# EasyEDA Pro project pcb.epro

# Schematic Schematic1
Board Name: Board1; Create Date: 2025-01-27; Page Name: P1; Project Name: pcb; Schematic Name: Schematic1; Update Date: 2025-01-28; Company: EasyEDA.com; Page Size: A4; Version: V1.0
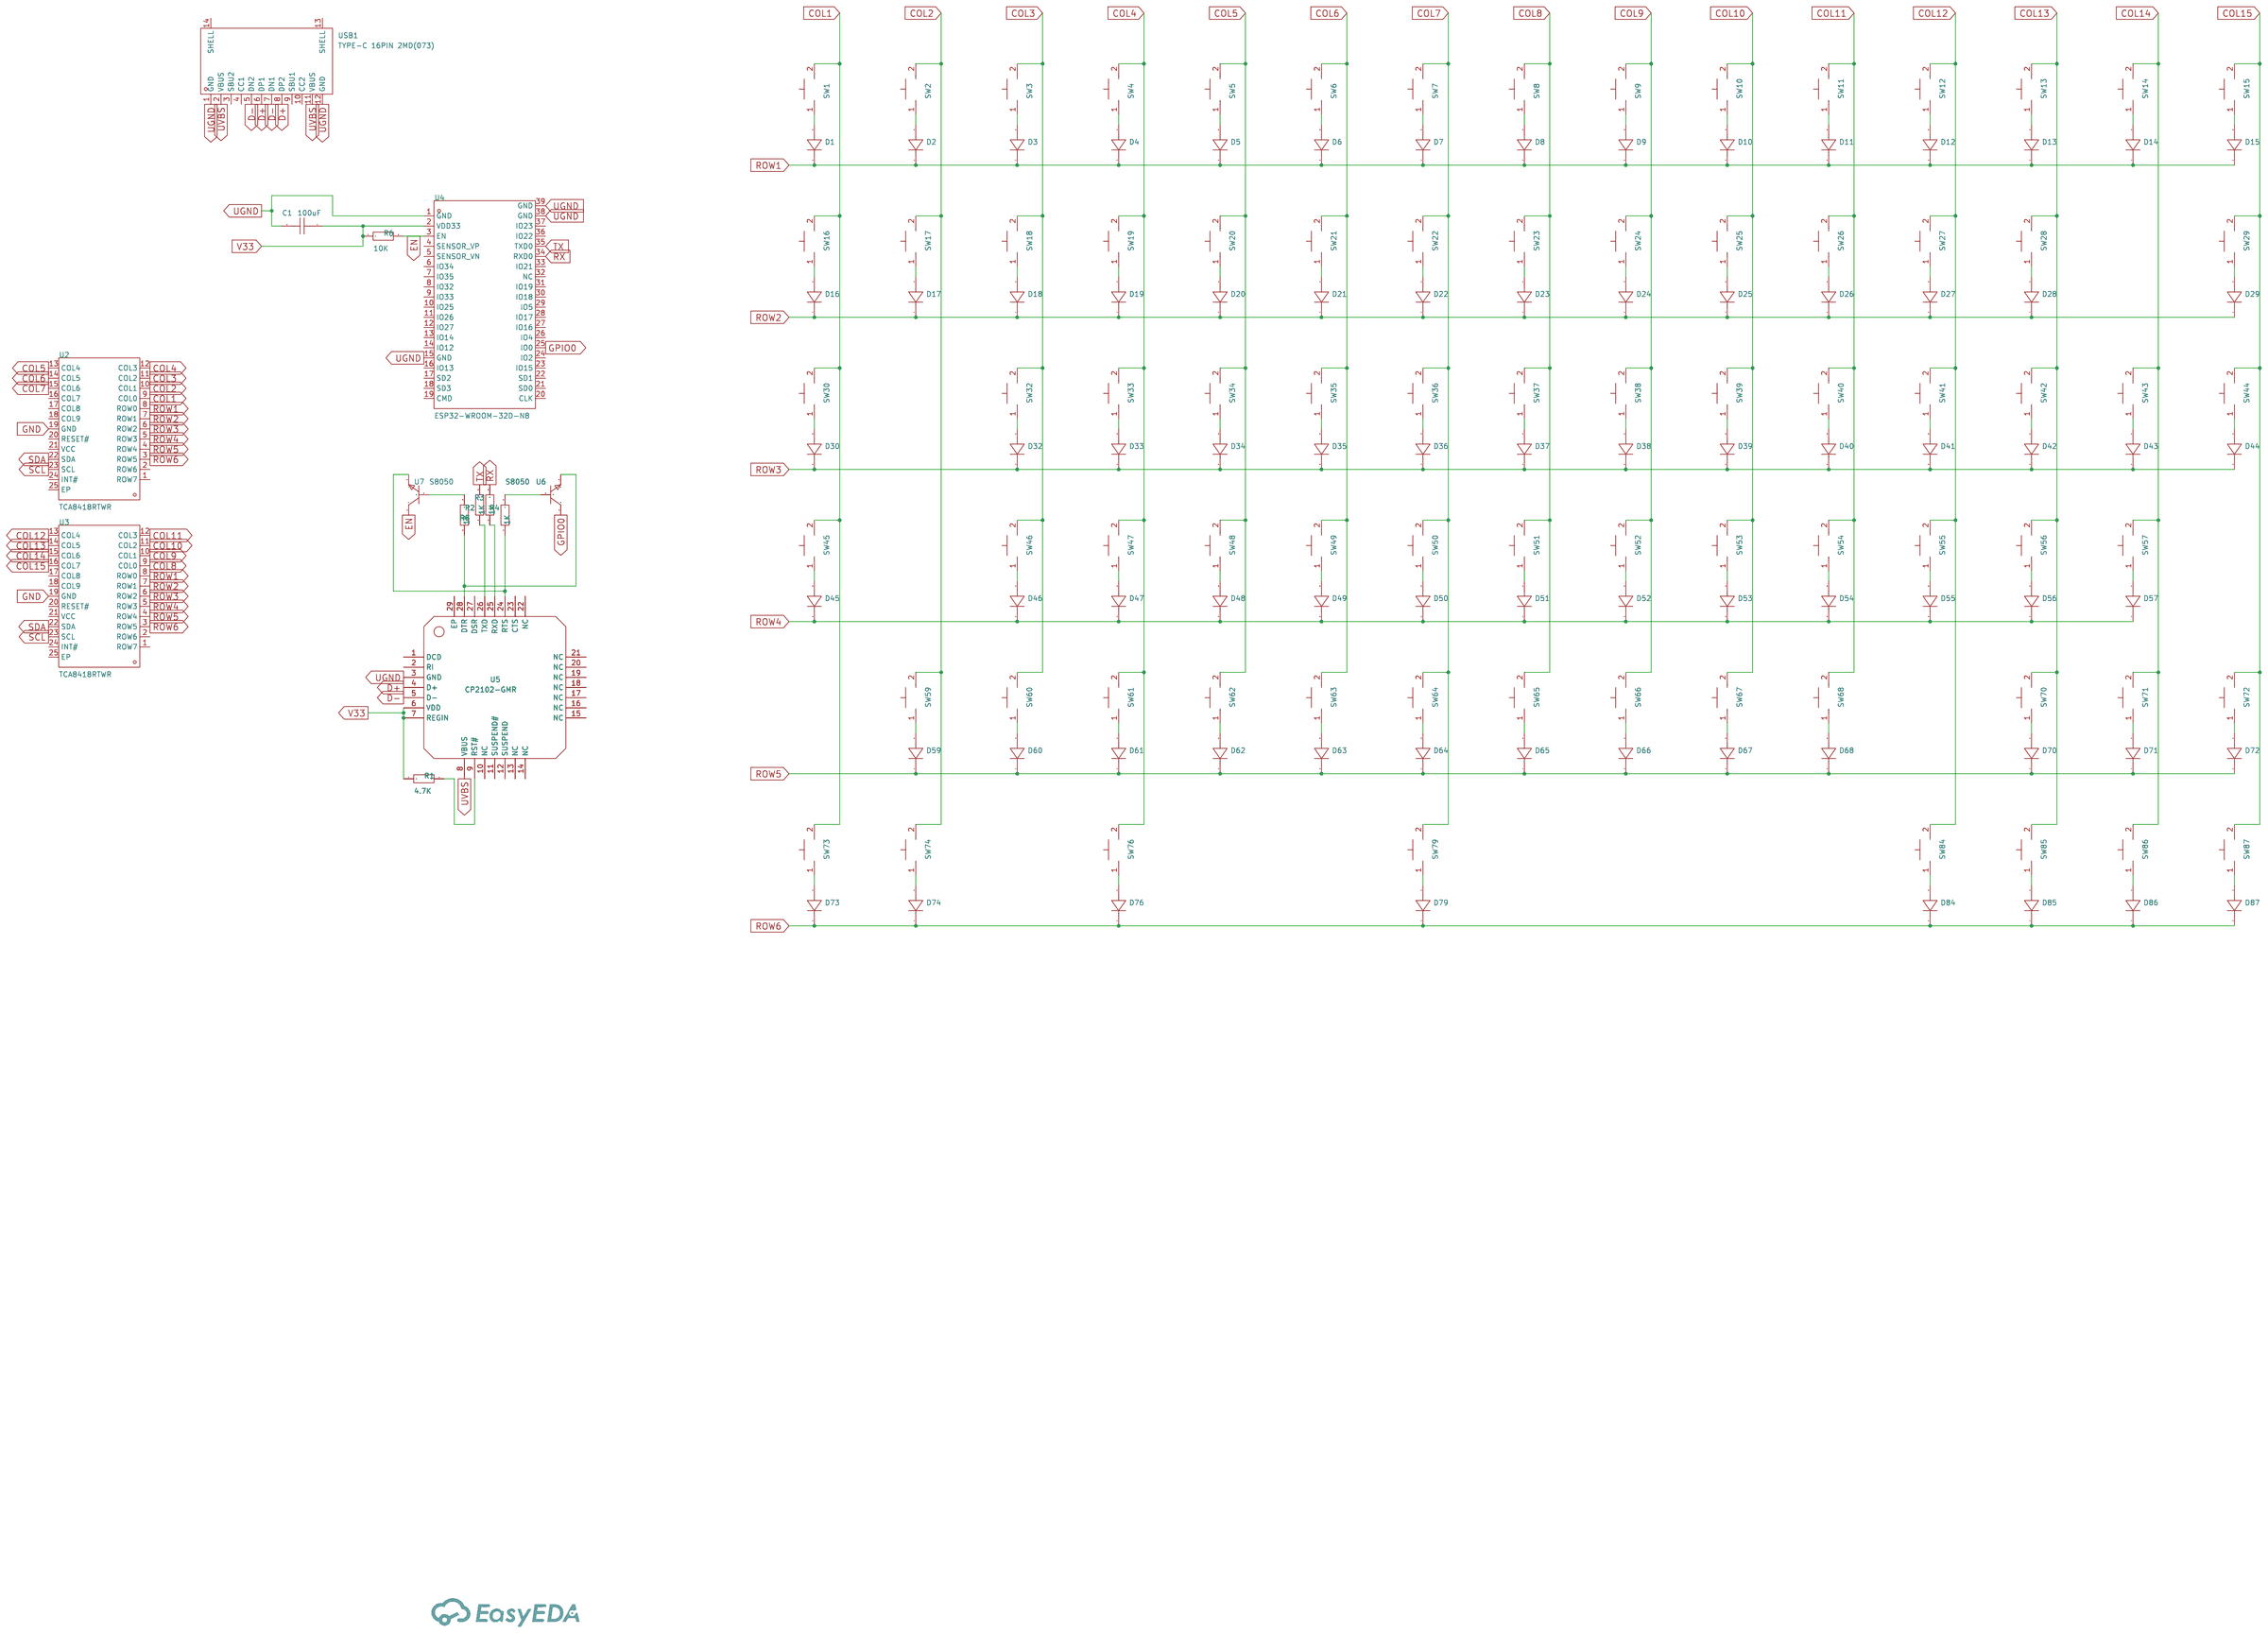
[diagram p0: schematic sheet]

## Parts
C1  100uF  [C0603]
D1  -  [DO-41_BD2.4-L4.7-P8.70-D0.9-RD]
D2  -  [DO-41_BD2.4-L4.7-P8.70-D0.9-RD]
D3  -  [DO-41_BD2.4-L4.7-P8.70-D0.9-RD]
D4  -  [DO-41_BD2.4-L4.7-P8.70-D0.9-RD]
D5  -  [DO-41_BD2.4-L4.7-P8.70-D0.9-RD]
D6  -  [DO-41_BD2.4-L4.7-P8.70-D0.9-RD]
D7  -  [DO-41_BD2.4-L4.7-P8.70-D0.9-RD]
D8  -  [DO-41_BD2.4-L4.7-P8.70-D0.9-RD]
D9  -  [DO-41_BD2.4-L4.7-P8.70-D0.9-RD]
D10  -  [DO-41_BD2.4-L4.7-P8.70-D0.9-RD]
D11  -  [DO-41_BD2.4-L4.7-P8.70-D0.9-RD]
D12  -  [DO-41_BD2.4-L4.7-P8.70-D0.9-RD]
D13  -  [DO-41_BD2.4-L4.7-P8.70-D0.9-RD]
D14  -  [DO-41_BD2.4-L4.7-P8.70-D0.9-RD]
D15  -  [DO-41_BD2.4-L4.7-P8.70-D0.9-RD]
D16  -  [DO-41_BD2.4-L4.7-P8.70-D0.9-RD]
D17  -  [DO-41_BD2.4-L4.7-P8.70-D0.9-RD]
D18  -  [DO-41_BD2.4-L4.7-P8.70-D0.9-RD]
D19  -  [DO-41_BD2.4-L4.7-P8.70-D0.9-RD]
D20  -  [DO-41_BD2.4-L4.7-P8.70-D0.9-RD]
D21  -  [DO-41_BD2.4-L4.7-P8.70-D0.9-RD]
D22  -  [DO-41_BD2.4-L4.7-P8.70-D0.9-RD]
D23  -  [DO-41_BD2.4-L4.7-P8.70-D0.9-RD]
D24  -  [DO-41_BD2.4-L4.7-P8.70-D0.9-RD]
D25  -  [DO-41_BD2.4-L4.7-P8.70-D0.9-RD]
D26  -  [DO-41_BD2.4-L4.7-P8.70-D0.9-RD]
D27  -  [DO-41_BD2.4-L4.7-P8.70-D0.9-RD]
D28  -  [DO-41_BD2.4-L4.7-P8.70-D0.9-RD]
D29  -  [DO-41_BD2.4-L4.7-P8.70-D0.9-RD]
D30  -  [DO-41_BD2.4-L4.7-P8.70-D0.9-RD]
D32  -  [DO-41_BD2.4-L4.7-P8.70-D0.9-RD]
D33  -  [DO-41_BD2.4-L4.7-P8.70-D0.9-RD]
D34  -  [DO-41_BD2.4-L4.7-P8.70-D0.9-RD]
D35  -  [DO-41_BD2.4-L4.7-P8.70-D0.9-RD]
D36  -  [DO-41_BD2.4-L4.7-P8.70-D0.9-RD]
D37  -  [DO-41_BD2.4-L4.7-P8.70-D0.9-RD]
D38  -  [DO-41_BD2.4-L4.7-P8.70-D0.9-RD]
D39  -  [DO-41_BD2.4-L4.7-P8.70-D0.9-RD]
D40  -  [DO-41_BD2.4-L4.7-P8.70-D0.9-RD]
D41  -  [DO-41_BD2.4-L4.7-P8.70-D0.9-RD]
D42  -  [DO-41_BD2.4-L4.7-P8.70-D0.9-RD]
D43  -  [DO-41_BD2.4-L4.7-P8.70-D0.9-RD]
D44  -  [DO-41_BD2.4-L4.7-P8.70-D0.9-RD]
D45  -  [DO-41_BD2.4-L4.7-P8.70-D0.9-RD]
D46  -  [DO-41_BD2.4-L4.7-P8.70-D0.9-RD]
D47  -  [DO-41_BD2.4-L4.7-P8.70-D0.9-RD]
D48  -  [DO-41_BD2.4-L4.7-P8.70-D0.9-RD]
D49  -  [DO-41_BD2.4-L4.7-P8.70-D0.9-RD]
D50  -  [DO-41_BD2.4-L4.7-P8.70-D0.9-RD]
D51  -  [DO-41_BD2.4-L4.7-P8.70-D0.9-RD]
D52  -  [DO-41_BD2.4-L4.7-P8.70-D0.9-RD]
D53  -  [DO-41_BD2.4-L4.7-P8.70-D0.9-RD]
D54  -  [DO-41_BD2.4-L4.7-P8.70-D0.9-RD]
D55  -  [DO-41_BD2.4-L4.7-P8.70-D0.9-RD]
D56  -  [DO-41_BD2.4-L4.7-P8.70-D0.9-RD]
D57  -  [DO-41_BD2.4-L4.7-P8.70-D0.9-RD]
D59  -  [DO-41_BD2.4-L4.7-P8.70-D0.9-RD]
D60  -  [DO-41_BD2.4-L4.7-P8.70-D0.9-RD]
D61  -  [DO-41_BD2.4-L4.7-P8.70-D0.9-RD]
D62  -  [DO-41_BD2.4-L4.7-P8.70-D0.9-RD]
D63  -  [DO-41_BD2.4-L4.7-P8.70-D0.9-RD]
D64  -  [DO-41_BD2.4-L4.7-P8.70-D0.9-RD]
D65  -  [DO-41_BD2.4-L4.7-P8.70-D0.9-RD]
D66  -  [DO-41_BD2.4-L4.7-P8.70-D0.9-RD]
D67  -  [DO-41_BD2.4-L4.7-P8.70-D0.9-RD]
D68  -  [DO-41_BD2.4-L4.7-P8.70-D0.9-RD]
D70  -  [DO-41_BD2.4-L4.7-P8.70-D0.9-RD]
D71  -  [DO-41_BD2.4-L4.7-P8.70-D0.9-RD]
D72  -  [DO-41_BD2.4-L4.7-P8.70-D0.9-RD]
D73  -  [DO-41_BD2.4-L4.7-P8.70-D0.9-RD]
D74  -  [DO-41_BD2.4-L4.7-P8.70-D0.9-RD]
D76  -  [DO-41_BD2.4-L4.7-P8.70-D0.9-RD]
D79  -  [DO-41_BD2.4-L4.7-P8.70-D0.9-RD]
D84  -  [DO-41_BD2.4-L4.7-P8.70-D0.9-RD]
D85  -  [DO-41_BD2.4-L4.7-P8.70-D0.9-RD]
D86  -  [DO-41_BD2.4-L4.7-P8.70-D0.9-RD]
D87  -  [DO-41_BD2.4-L4.7-P8.70-D0.9-RD]
R1  4.7K  [R0603]
R2  1K  [R0603]
R3  1K  [R0603]
R4  1K  [R0603]
R5  1K  [R0603]
R6  10K  [R0603]
SW1  CPG151101S11-16  [SMD_KEYBOARD-SW]
SW2  CPG151101S11-16  [SMD_KEYBOARD-SW]
SW3  CPG151101S11-16  [SMD_KEYBOARD-SW]
SW4  CPG151101S11-16  [SMD_KEYBOARD-SW]
SW5  CPG151101S11-16  [SMD_KEYBOARD-SW]
SW6  CPG151101S11-16  [SMD_KEYBOARD-SW]
SW7  CPG151101S11-16  [SMD_KEYBOARD-SW]
SW8  CPG151101S11-16  [SMD_KEYBOARD-SW]
SW9  CPG151101S11-16  [SMD_KEYBOARD-SW]
SW10  CPG151101S11-16  [SMD_KEYBOARD-SW]
SW11  CPG151101S11-16  [SMD_KEYBOARD-SW]
SW12  CPG151101S11-16  [SMD_KEYBOARD-SW]
SW13  CPG151101S11-16  [SMD_KEYBOARD-SW]
SW14  CPG151101S11-16  [SMD_KEYBOARD-SW]
SW15  CPG151101S11-16  [SMD_KEYBOARD-SW]
SW16  CPG151101S11-16  [SMD_KEYBOARD-SW]
SW17  CPG151101S11-16  [SMD_KEYBOARD-SW]
SW18  CPG151101S11-16  [SMD_KEYBOARD-SW]
SW19  CPG151101S11-16  [SMD_KEYBOARD-SW]
SW20  CPG151101S11-16  [SMD_KEYBOARD-SW]
SW21  CPG151101S11-16  [SMD_KEYBOARD-SW]
SW22  CPG151101S11-16  [SMD_KEYBOARD-SW]
SW23  CPG151101S11-16  [SMD_KEYBOARD-SW]
SW24  CPG151101S11-16  [SMD_KEYBOARD-SW]
SW25  CPG151101S11-16  [SMD_KEYBOARD-SW]
SW26  CPG151101S11-16  [SMD_KEYBOARD-SW]
SW27  CPG151101S11-16  [SMD_KEYBOARD-SW]
SW28  CPG151101S11-16  [SMD_KEYBOARD-SW]
SW29  CPG151101S11-16  [SMD_KEYBOARD-SW]
SW30  CPG151101S11-16  [SMD_KEYBOARD-SW]
SW32  CPG151101S11-16  [SMD_KEYBOARD-SW]
SW33  CPG151101S11-16  [SMD_KEYBOARD-SW]
SW34  CPG151101S11-16  [SMD_KEYBOARD-SW]
SW35  CPG151101S11-16  [SMD_KEYBOARD-SW]
SW36  CPG151101S11-16  [SMD_KEYBOARD-SW]
SW37  CPG151101S11-16  [SMD_KEYBOARD-SW]
SW38  CPG151101S11-16  [SMD_KEYBOARD-SW]
SW39  CPG151101S11-16  [SMD_KEYBOARD-SW]
SW40  CPG151101S11-16  [SMD_KEYBOARD-SW]
SW41  CPG151101S11-16  [SMD_KEYBOARD-SW]
SW42  CPG151101S11-16  [SMD_KEYBOARD-SW]
SW43  CPG151101S11-16  [SMD_KEYBOARD-SW]
SW44  CPG151101S11-16  [SMD_KEYBOARD-SW]
SW45  CPG151101S11-16  [SMD_KEYBOARD-SW]
SW46  CPG151101S11-16  [SMD_KEYBOARD-SW]
SW47  CPG151101S11-16  [SMD_KEYBOARD-SW]
SW48  CPG151101S11-16  [SMD_KEYBOARD-SW]
SW49  CPG151101S11-16  [SMD_KEYBOARD-SW]
SW50  CPG151101S11-16  [SMD_KEYBOARD-SW]
SW51  CPG151101S11-16  [SMD_KEYBOARD-SW]
SW52  CPG151101S11-16  [SMD_KEYBOARD-SW]
SW53  CPG151101S11-16  [SMD_KEYBOARD-SW]
SW54  CPG151101S11-16  [SMD_KEYBOARD-SW]
SW55  CPG151101S11-16  [SMD_KEYBOARD-SW]
SW56  CPG151101S11-16  [SMD_KEYBOARD-SW]
SW57  CPG151101S11-16  [SMD_KEYBOARD-SW]
SW59  CPG151101S11-16  [SMD_KEYBOARD-SW]
SW60  CPG151101S11-16  [SMD_KEYBOARD-SW]
SW61  CPG151101S11-16  [SMD_KEYBOARD-SW]
SW62  CPG151101S11-16  [SMD_KEYBOARD-SW]
SW63  CPG151101S11-16  [SMD_KEYBOARD-SW]
SW64  CPG151101S11-16  [SMD_KEYBOARD-SW]
SW65  CPG151101S11-16  [SMD_KEYBOARD-SW]
SW66  CPG151101S11-16  [SMD_KEYBOARD-SW]
SW67  CPG151101S11-16  [SMD_KEYBOARD-SW]
SW68  CPG151101S11-16  [SMD_KEYBOARD-SW]
SW70  CPG151101S11-16  [SMD_KEYBOARD-SW]
SW71  CPG151101S11-16  [SMD_KEYBOARD-SW]
SW72  CPG151101S11-16  [SMD_KEYBOARD-SW]
SW73  CPG151101S11-16  [SMD_KEYBOARD-SW]
SW74  CPG151101S11-16  [SMD_KEYBOARD-SW]
SW76  CPG151101S11-16  [SMD_KEYBOARD-SW]
SW79  CPG151101S11-16  [SMD_KEYBOARD-SW]
SW84  CPG151101S11-16  [SMD_KEYBOARD-SW]
SW85  CPG151101S11-16  [SMD_KEYBOARD-SW]
SW86  CPG151101S11-16  [SMD_KEYBOARD-SW]
SW87  CPG151101S11-16  [SMD_KEYBOARD-SW]
U2  TCA8418RTWR  [WQFN-24_L4.0-W4.0-P0.50-TL-EP2.5]
U3  TCA8418RTWR  [WQFN-24_L4.0-W4.0-P0.50-TL-EP2.5]
U4  ESP32-WROOM-32D-N8  [WIFIM-SMD_39P-L25.5-W18.0-P1.27]
U5  CP2102-GMR  [WQFN-28_L5.0-W5.0-P0.50-BL-EP3.2]
U6  S8050  [SOT-23-3_L2.9-W1.3-P0.95-LS2.4-BR]
U7  S8050  [SOT-23-3_L2.9-W1.3-P0.95-LS2.4-BR]
USB1  TYPE-C 16PIN 2MD(073)  [USB-C-SMD_TYPE-C-6PIN-2MD-073]

## Library data of the parts
C1 = CAP_0603: Supplier Footprint: 0603
D1-D30 D32-D57 D59-D68 D70-D74 D76 D79 D84-D87 = 1N4007: Supplier Footprint: DO-41
R1-R6 = Res_0603: Supplier Footprint: 0603
SW1-SW30 SW32-SW57 SW59-SW68 SW70-SW74 SW76 SW79 SW84-SW87 = CPG151101S11-16_C41430893: LCSC Part Name: 热插拔底座连接器 键盘配件; Supplier Part: C41430893; Manufacturer: HanElectricity(瀚源); Supplier Footprint: SMD,14.5x5.9mm; JLCPCB Part Class: Extended Part; Datasheet: https://atta.szlcsc.com/upload/public/pdf/source/20241016/CAB9C3DABBAD4306660C041376EEF732.pdf; Supplier: LCSC
U2 U3 = TCA8418RTWR: Interface:I2C Number of I/O:18 Interrupt Output:With Interrupt Output Output Type:Leakage Supply Voltage:1.65V~3.6V Supply Voltage:1.65V~3.6V Output Source current:- Output Sink Current:- Clock Frequency:1MHz Operating Temperature:-40℃~+85℃ Operating Temp; LCSC Part Name: TCA8418集成ESD保护的I²C控制键盘扫描IC; Supplier Part: C138713; Manufacturer: TI(德州仪器); Supplier Footprint: WQFN-24-EP(4x4); JLCPCB Part Class: Extended Part; Datasheet: https://www.ti.com/cn/lit/gpn/tca8418; Supplier: LCSC; Interface: I2C; Number of I/O: 18; Interrupt Output: With Interrupt Output; Output Type: Leakage; Supply Voltage: 1.65V~3.6V; Clock Frequency: 1MHz; Operating Temperature: -40℃~+85℃
U4 = ESP32-WROOM-32D-N8: LCSC Part Name: 通用型Wi-Fi+BT+BLE MCU模组; Supplier Part: C529577; Manufacturer: ESPRESSIF(乐鑫); Supplier Footprint: SMD,18x25.5mm; JLCPCB Part Class: Extended Part; Datasheet: https://atta.szlcsc.com/upload/public/pdf/source/20241030/FABBD8327B67EE0A7C31EF04AF2F47D2.pdf; Supplier: LCSC
U5 = CP2102-GMR: Applications Function:Transceiver Protocol: Number of Channels:- Supply Voltage:3V~3.6V Supply Voltage:3V~3.6V Data Rate:12Mbps Operating Temperature:- Operating Temperature:-; LCSC Part Name: 单芯片USB转UART桥接器; Supplier Part: C6568; Manufacturer: SKYWORKS/SILICON LABS(芯科); Supplier Footprint: WQFN-28-EP(5x5); JLCPCB Part Class: Extended Part; Datasheet: https://atta.szlcsc.com/upload/public/pdf/source/20170103/1483439882795.pdf; Supplier: LCSC; Applications Function: Transceiver; Supply Voltage: 3V~3.6V; Data Rate: 12Mbps
U6 U7 = S8050_C18195380: Supplier Part: C18195380; Manufacturer: LJ(朗捷）; Supplier Footprint: SOT-23; JLCPCB Part Class: Extended Part; Datasheet: https://atta.szlcsc.com/upload/public/pdf/source/20230921/A588E058E59BF9C5C88E8D353EF40AF6.pdf; Supplier: LCSC
USB1 = TYPE-C 16PIN 2MD(073): Connector Type:Type-C Standard:USB 3.1 Gender:Female Mounting Style:Horizontal attachment Number of Contacts:16P Number of Ports:1 Current Rating - Power (Max):5A Operating Temperature Range:-25℃~+85℃ Operating Temperature Range:-25℃~+85℃ Rated Voltage (M; LCSC Part Name: Type-C 母 卧贴; Supplier Part: C2765186; Manufacturer: SHOU HAN(首韩); Supplier Footprint: SMD; JLCPCB Part Class: Extended Part; Datasheet: https://atta.szlcsc.com/upload/public/pdf/source/20211123/39B17C16241EAC15C5E277BDA434118E.pdf; Supplier: LCSC; Connector Type: Type-C; Standard: USB 3.1; Gender: Female; Mounting Style: Horizontal attachment; Number of Contacts: 16P; Number of Ports: 1; Current Rating - Power (Max): 5A; Operating Temperature Range: -25℃~+85℃; Rated Voltage (Max): 5V; Connect-Disconnect Life: 5000 Cuts; Core Colour: Black

## Nets
GND: U2.19(GND) U3.19(GND)
V33: C1.1 R1.1 R6.1 U4.2(VDD33) U5.6(VDD) U5.7(REGIN)
COL1: SW1.2 SW16.2 SW30.2 SW45.2 SW73.2 U2.9(COL0)
COL2: SW2.2 SW17.2 SW59.2 SW74.2 U2.10(COL1)
COL3: SW3.2 SW18.2 SW32.2 SW46.2 SW60.2 U2.11(COL2)
COL4: SW4.2 SW19.2 SW33.2 SW47.2 SW61.2 SW76.2 U2.12(COL3)
COL5: SW5.2 SW20.2 SW34.2 SW48.2 SW62.2 U2.13(COL4)
COL6: SW6.2 SW21.2 SW35.2 SW49.2 SW63.2 U2.14(COL5)
COL7: SW7.2 SW22.2 SW36.2 SW50.2 SW64.2 SW79.2 U2.15(COL6)
COL8: SW8.2 SW23.2 SW37.2 SW51.2 SW65.2 U3.9(COL0)
COL9: SW9.2 SW24.2 SW38.2 SW52.2 SW66.2 U3.10(COL1)
COL10: SW10.2 SW25.2 SW39.2 SW53.2 SW67.2 U3.11(COL2)
COL11: SW11.2 SW26.2 SW40.2 SW54.2 SW68.2 U3.12(COL3)
COL12: SW12.2 SW27.2 SW41.2 SW55.2 SW84.2 U3.13(COL4)
COL13: SW13.2 SW28.2 SW42.2 SW56.2 SW70.2 SW85.2 U3.14(COL5)
COL14: SW14.2 SW43.2 SW57.2 SW71.2 SW86.2 U3.15(COL6)
COL15: SW15.2 SW29.2 SW44.2 SW72.2 SW87.2 U3.16(COL7)
D+: U5.4(D+) USB1.6(DP1) USB1.8(DP2)
D-: U5.5(D-) USB1.5(DN2) USB1.7(DN1)
EN: R6.2 U4.3(EN) U7.3(C)
GPIO0: U4.25(IO0) U6.3(C)
ROW1: D1.1(K) D2.1(K) D3.1(K) D4.1(K) D5.1(K) D6.1(K) D7.1(K) D8.1(K) D9.1(K) D10.1(K) D11.1(K) D12.1(K) D13.1(K) D14.1(K) D15.1(K) U2.8(ROW0) U3.8(ROW0)
ROW2: D16.1(K) D17.1(K) D18.1(K) D19.1(K) D20.1(K) D21.1(K) D22.1(K) D23.1(K) D24.1(K) D25.1(K) D26.1(K) D27.1(K) D28.1(K) D29.1(K) U2.7(ROW1) U3.7(ROW1)
ROW3: D30.1(K) D32.1(K) D33.1(K) D34.1(K) D35.1(K) D36.1(K) D37.1(K) D38.1(K) D39.1(K) D40.1(K) D41.1(K) D42.1(K) D43.1(K) D44.1(K) U2.6(ROW2) U3.6(ROW2)
ROW4: D45.1(K) D46.1(K) D47.1(K) D48.1(K) D49.1(K) D50.1(K) D51.1(K) D52.1(K) D53.1(K) D54.1(K) D55.1(K) D56.1(K) D57.1(K) U2.5(ROW3) U3.5(ROW3)
ROW5: D59.1(K) D60.1(K) D61.1(K) D62.1(K) D63.1(K) D64.1(K) D65.1(K) D66.1(K) D67.1(K) D68.1(K) D70.1(K) D71.1(K) D72.1(K) U2.4(ROW4) U3.4(ROW4)
ROW6: D73.1(K) D74.1(K) D76.1(K) D79.1(K) D84.1(K) D85.1(K) D86.1(K) D87.1(K) U2.3(ROW5) U3.3(ROW5)
RX: R3.2 U4.34(RXD0)
SCL: U2.23(SCL) U3.23(SCL)
SDA: U2.22(SDA) U3.22(SDA)
TX: R2.2 U4.35(TXD0)
UGND: C1.2 U4.1(GND) U4.15(GND) U4.38(GND) U4.39(GND) U5.3(GND) USB1.1(GND) USB1.12(GND)
UVBS: U5.8(VBUS) USB1.2(VBUS) USB1.11(VBUS)
Net-(D1-2): D1.2(A) SW1.1
Net-(D2-2): D2.2(A) SW2.1
Net-(D3-2): D3.2(A) SW3.1
Net-(D4-2): D4.2(A) SW4.1
Net-(D5-2): D5.2(A) SW5.1
Net-(D6-2): D6.2(A) SW6.1
Net-(D7-2): D7.2(A) SW7.1
Net-(D8-2): D8.2(A) SW8.1
Net-(D9-2): D9.2(A) SW9.1
Net-(D10-2): D10.2(A) SW10.1
Net-(D11-2): D11.2(A) SW11.1
Net-(D12-2): D12.2(A) SW12.1
Net-(D13-2): D13.2(A) SW13.1
Net-(D14-2): D14.2(A) SW14.1
Net-(D15-2): D15.2(A) SW15.1
Net-(D16-2): D16.2(A) SW16.1
Net-(D17-2): D17.2(A) SW17.1
Net-(D18-2): D18.2(A) SW18.1
Net-(D19-2): D19.2(A) SW19.1
Net-(D20-2): D20.2(A) SW20.1
Net-(D21-2): D21.2(A) SW21.1
Net-(D22-2): D22.2(A) SW22.1
Net-(D23-2): D23.2(A) SW23.1
Net-(D24-2): D24.2(A) SW24.1
Net-(D25-2): D25.2(A) SW25.1
Net-(D26-2): D26.2(A) SW26.1
Net-(D27-2): D27.2(A) SW27.1
Net-(D28-2): D28.2(A) SW28.1
Net-(D29-2): D29.2(A) SW29.1
Net-(D30-2): D30.2(A) SW30.1
Net-(D32-2): D32.2(A) SW32.1
Net-(D33-2): D33.2(A) SW33.1
Net-(D34-2): D34.2(A) SW34.1
Net-(D35-2): D35.2(A) SW35.1
Net-(D36-2): D36.2(A) SW36.1
Net-(D37-2): D37.2(A) SW37.1
Net-(D38-2): D38.2(A) SW38.1
Net-(D39-2): D39.2(A) SW39.1
Net-(D40-2): D40.2(A) SW40.1
Net-(D41-2): D41.2(A) SW41.1
Net-(D42-2): D42.2(A) SW42.1
Net-(D43-2): D43.2(A) SW43.1
Net-(D44-2): D44.2(A) SW44.1
Net-(D45-2): D45.2(A) SW45.1
Net-(D46-2): D46.2(A) SW46.1
Net-(D47-2): D47.2(A) SW47.1
Net-(D48-2): D48.2(A) SW48.1
Net-(D49-2): D49.2(A) SW49.1
Net-(D50-2): D50.2(A) SW50.1
Net-(D51-2): D51.2(A) SW51.1
Net-(D52-2): D52.2(A) SW52.1
Net-(D53-2): D53.2(A) SW53.1
Net-(D54-2): D54.2(A) SW54.1
Net-(D55-2): D55.2(A) SW55.1
Net-(D56-2): D56.2(A) SW56.1
Net-(D57-2): D57.2(A) SW57.1
Net-(D59-2): D59.2(A) SW59.1
Net-(D60-2): D60.2(A) SW60.1
Net-(D61-2): D61.2(A) SW61.1
Net-(D62-2): D62.2(A) SW62.1
Net-(D63-2): D63.2(A) SW63.1
Net-(D64-2): D64.2(A) SW64.1
Net-(D65-2): D65.2(A) SW65.1
Net-(D66-2): D66.2(A) SW66.1
Net-(D67-2): D67.2(A) SW67.1
Net-(D68-2): D68.2(A) SW68.1
Net-(D70-2): D70.2(A) SW70.1
Net-(D71-2): D71.2(A) SW71.1
Net-(D72-2): D72.2(A) SW72.1
Net-(D73-2): D73.2(A) SW73.1
Net-(D74-2): D74.2(A) SW74.1
Net-(D76-2): D76.2(A) SW76.1
Net-(D79-2): D79.2(A) SW79.1
Net-(D84-2): D84.2(A) SW84.1
Net-(D85-2): D85.2(A) SW85.1
Net-(D86-2): D86.2(A) SW86.1
Net-(D87-2): D87.2(A) SW87.1
Net-(R1-2): R1.2 U5.9(RST#)
Net-(R2-1): R2.1 U5.26(TXD)
Net-(R3-1): R3.1 U5.25(RXD)
Net-(R4-1): R4.1 U5.24(RTS) U7.2(E)
Net-(R4-2): R4.2 U6.1(B)
Net-(R5-1): R5.1 U5.28(DTR) U6.2(E)
Net-(R5-2): R5.2 U7.1(B)

Not connected (* = marked no-connect by the designer): U2 1(ROW7) 2(ROW6) 16(COL7) 17(COL8) 18(COL9) 20(RESET#) 21(VCC) 24(INT#) 25(EP); U3 1(ROW7) 2(ROW6) 17(COL8) 18(COL9) 20(RESET#) 21(VCC) 24(INT#) 25(EP); U4 4(SENSOR_VP) 5(SENSOR_VN) 6(IO34) 7(IO35) 8(IO32) 9(IO33) 10(IO25) 11(IO26) 12(IO27) 13(IO14) 14(IO12) 16(IO13) 17(SD2) 18(SD3) 19(CMD) 20(CLK) 21(SD0) 22(SD1) 23(IO15) 24(IO2) 26(IO4) 27(IO16) 28(IO17) 29(IO5) 30(IO18) 31(IO19) 32(NC) 33(IO21) 36(IO22) 37(IO23); U5 1(DCD) 2(RI) 10(NC) 11(SUSPEND#) 12(SUSPEND) 13(NC) 14(NC) 15(NC) 16(NC) 17(NC) 18(NC) 19(NC) 20(NC) 21(NC) 22(NC) 23(CTS) 27(DSR) 29(EP); USB1 3(SBU2) 4(CC1) 9(SBU1) 10(CC2) 13(SHELL) 14(SHELL)
